# Altium project lamp_controller.PrjPcb (part 3 of 4)
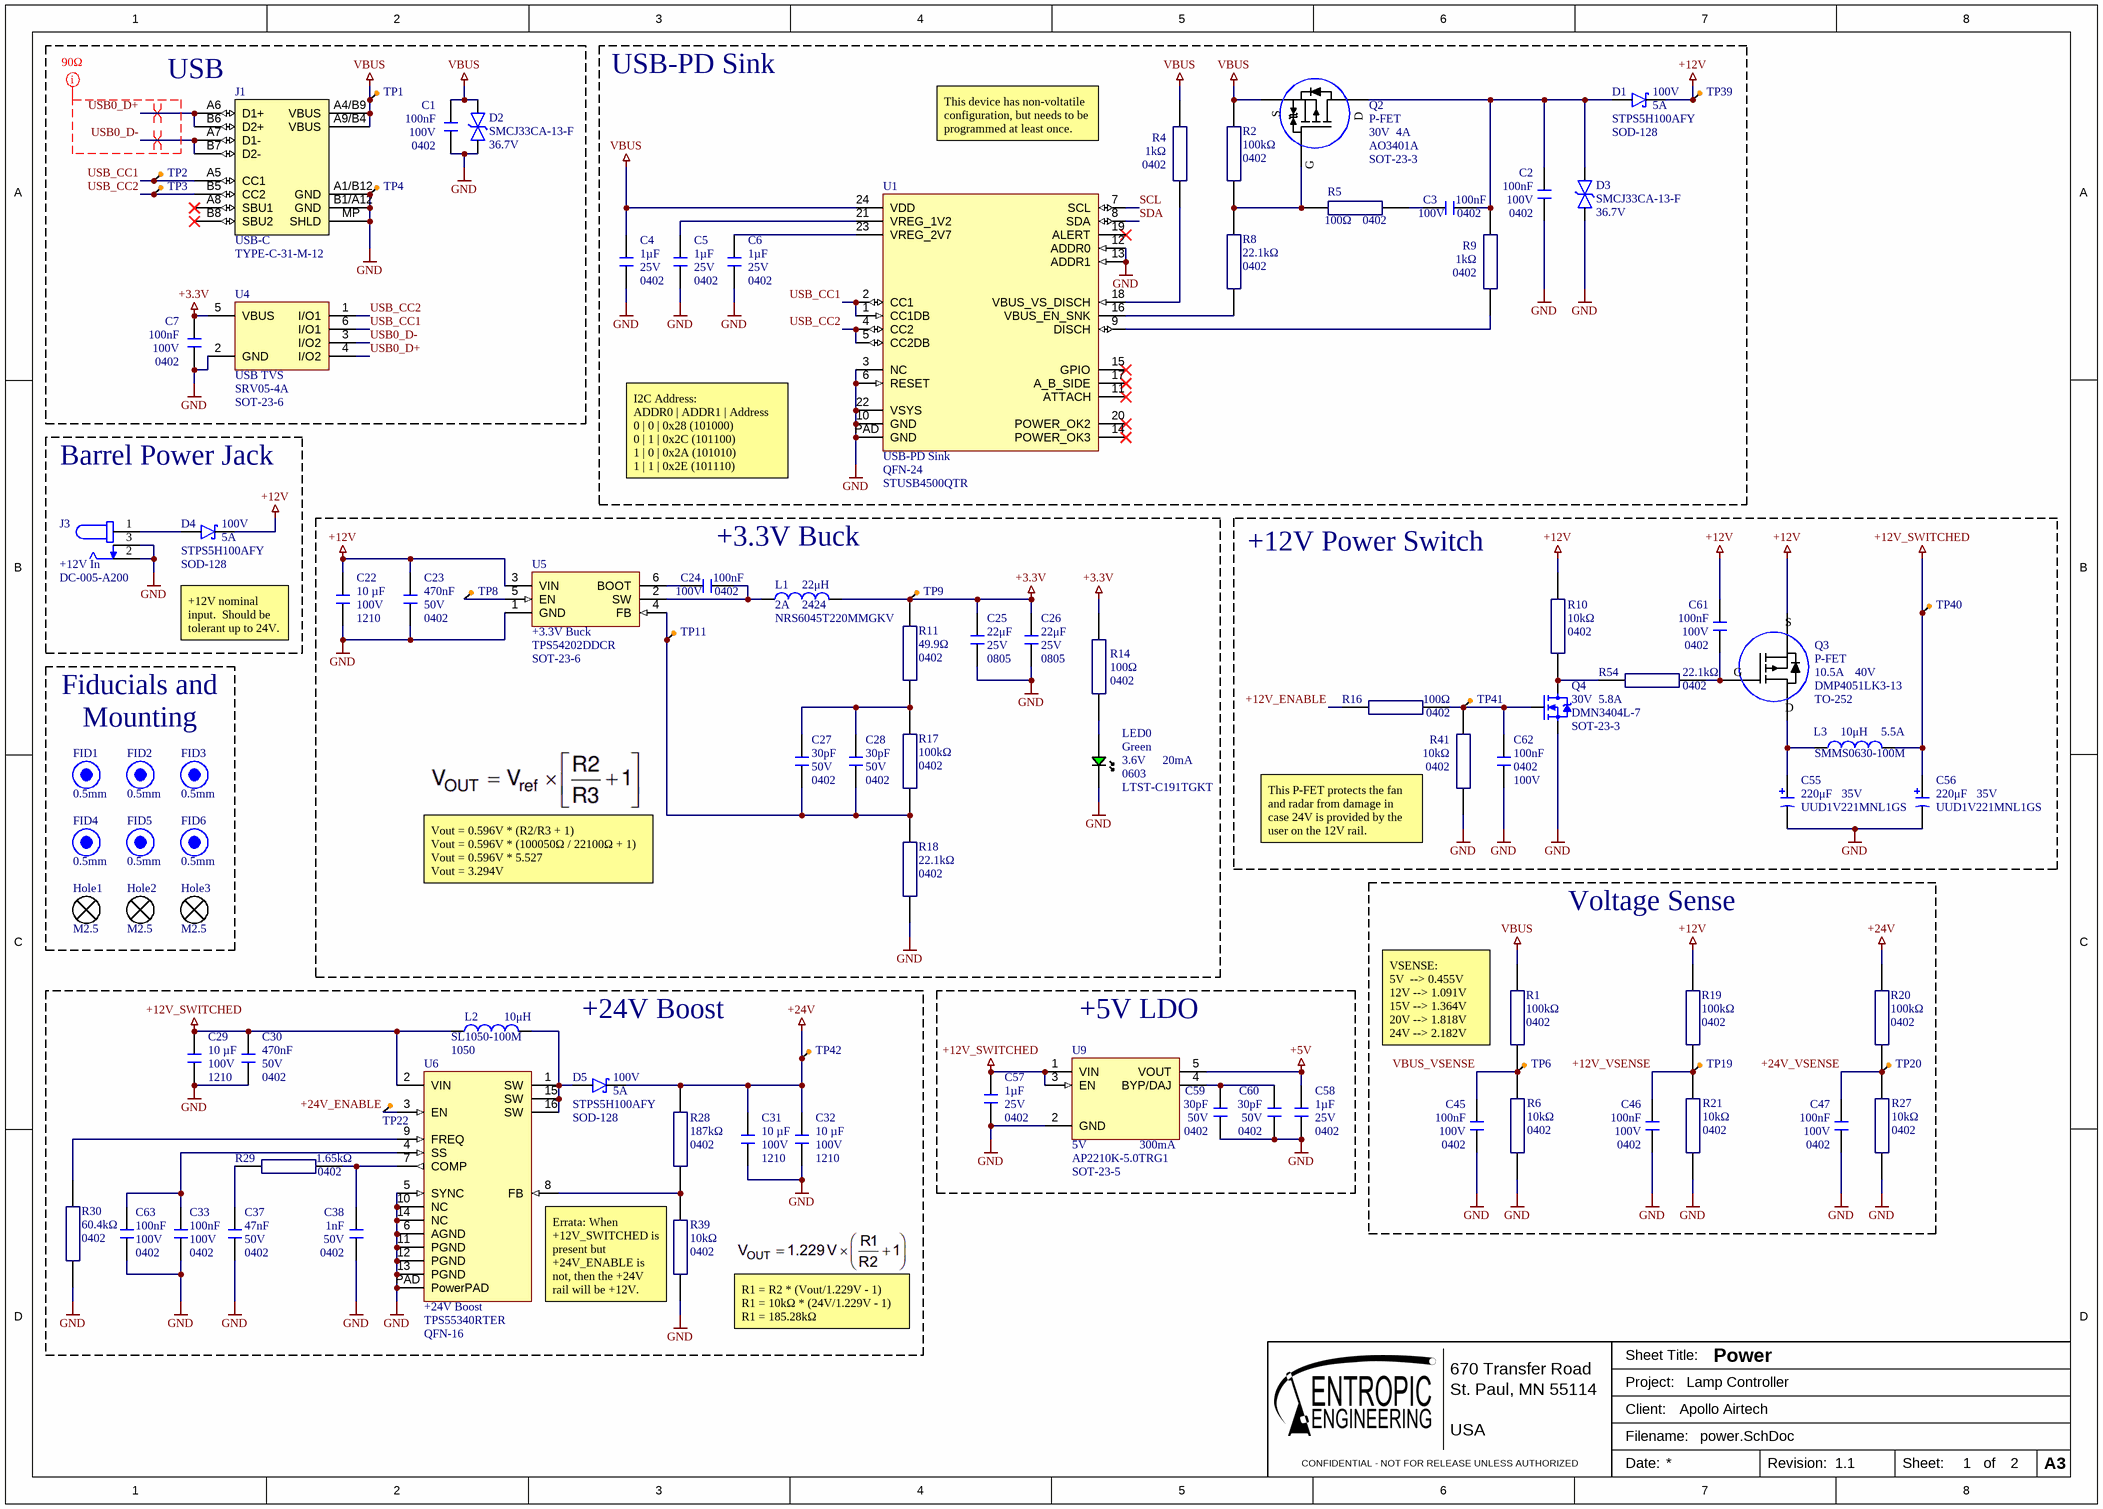
[diagram p4: power.SchDoc]

## Sheet power.SchDoc: Power (continued)

### Library data of the parts (continued)
R54 = RC0402FR-0722K1L: 22.1 kΩ, 1%, 0402 Resistor; Manufacturer: Yageo; Additional Feature: LASER TRIMMABLE; Power: 62.5mW; Rated Temperature: 70°C; Working Voltage: 50V; Temperature Coefficient (ppm/Cel): 100; Package Height: 0.35mm; Package Length: 1mm; Package Width: 0.5mm; Supplier 1: Digikey; Supplier Part Number 1: 311-22.1KLRCT-ND; RoHS: Yes; Category: Chip SMD Resistors; Stock 1: 259657; Pricing 1: 1=0.1, 10=0.008, 100=0.0061, 1000=0.0051, 10000=0.00123 (USD); Min Operating Temperature: -55°C; Max Operating Temperature: 155°C; Tolerance: 1%; Packaging: Tape and Reel; Resistor Type: FIXED RESISTOR; Construction: Chip; RoHS Compliant: Yes; ComponentLink1URL: https://datasheet.ciiva.com:443/pdfs/VipMasterIC/IC/YAGO/YAGO-S-A0008145938/YAGO-S-A0008145938-1.pdf?src-supplier=IHS+Markit; ComponentLink1Description: https://datasheet.ciiva.com:443/pdfs/VipMasterIC/IC/YAGO/YAGO-S-A0008145938/YAGO-S-A0008145938-1.pdf?src-supplier=IHS+Markit; ComponentLink2URL: https://datasheet.ciiva.com/2553/pyu-r-int-thick-7-2553200.pdf?src-supplier=Digikey; ComponentLink2Description: https://datasheet.ciiva.com/2553/pyu-r-int-thick-7-2553200.pdf?src-supplier=Digikey; ComponentLink3URL: https://datasheet.ciiva.com/2553/pyu-r-int-thick-7-2553201.pdf?src-supplier=Digikey; ComponentLink3Description: https://datasheet.ciiva.com/2553/pyu-r-int-thick-7-2553201.pdf?src-supplier=Digikey; ComponentLink4URL: https://datasheet.ciiva.com/2553/pyu-r-int-thick-7-2553202.pdf?src-supplier=Digikey; ComponentLink4Description: https://datasheet.ciiva.com/2553/pyu-r-int-thick-7-2553202.pdf?src-supplier=Digikey; ComponentLink5URL: https://datasheet.ciiva.com/15189/getdatasheetpartid-251817-15189388.pdf?src-supplier=Verical; ComponentLink5Description: https://datasheet.ciiva.com/15189/getdatasheetpartid-251817-15189388.pdf?src-supplier=Verical; Manufacturer Part Number: RC0402FR-0722K1L; Mounting Technology: Surface Mount; Pins: 2; Package Shape: Rectangular; Terminal Finish: Nickel; JESD-609 Code: e3; Technology: METAL GLAZE/THICK FILM; Termination: Wraparound; Reach SVHC Compliant: Yes; ComponentLink6URL: https://datasheet.ciiva.com/7983/1018594-7983501.pdf?src-supplier=Element14; ComponentLink6Description: https://datasheet.ciiva.com/7983/1018594-7983501.pdf?src-supplier=Element14
TP1-TP4 TP6 TP8 TP9 TP11 TP19 TP20 TP22 TP39-TP42 = test_point-1: Test point; pickable: no
U1 = STUSB4500QTR: USB PD Sink; Manufacturer: STMicroelectronics; Consumer IC Type: CONSUMER CIRCUIT; Supplier 1: LCSC; RoHS: Yes; Category: USB Interface ICs; Stock 1: 9434; Pricing 1: 1=1.8642, 10=1.5172, 30=1.3685, 100=1.183, 1000=1.0509, 2000=1.0343 (USD); Reach SVHC Compliant: Yes; RoHS Compliant: Yes; ComponentLink1URL: https://datasheet.ciiva.com:443/pdfs/VipMasterIC/IC/SGST/SGST-S-A0009451278/SGST-S-A0009451278-1.pdf?src-supplier=IHS+Markit; ComponentLink1Description: https://datasheet.ciiva.com:443/pdfs/VipMasterIC/IC/SGST/SGST-S-A0009451278/SGST-S-A0009451278-1.pdf?src-supplier=IHS+Markit; ComponentLink2URL: http://www.farnell.com/datasheets/2710898.pdf?src-supplier=Farnell; ComponentLink2Description: http://www.farnell.com/datasheets/2710898.pdf?src-supplier=Farnell; ComponentLink3URL: http://www.farnell.com/datasheets/2710898.pdf?src-supplier=Element14; ComponentLink3Description: http://www.farnell.com/datasheets/2710898.pdf?src-supplier=Element14; ComponentLink4URL: http://www.farnell.com/datasheets/2710898.pdf?src-supplier=Newark; ComponentLink4Description: http://www.farnell.com/datasheets/2710898.pdf?src-supplier=Newark; ComponentLink5URL: http://www.st.com/content/ccc/resource/technical/document/datasheet/group3/1c/4a/55/d7/17/01/44/86/DM00489312/files/DM00489312.pdf/jcr:content/translations/en.DM00489312.pdf?src-supplier=Digikey; ComponentLink5Description: http://www.st.com/content/ccc/resource/technical/document/datasheet/group3/1c/4a/55/d7/17/01/44/86/DM00489312/files/DM00489312.pdf/jcr:content/translations/en.DM00489312.pdf?src-supplier=Digikey; Supplier Part Number 1: C2678061; Package: QFN-24; Manufacturer Part Number: STUSB4500QTR
U4 = SRV05-4A: TVS DIODE ARRAY SOT23-6; Manufacturer: SMC Diodes; Direction: Unidirectional,Bidirectional; Capacitance: 3.5pF; Operating Supply Voltage: 1.1V; Number of Channels: 2; Breakdown Voltage: 6V; Clamping Voltage: 17V; Reverse Standoff Voltage: 5.25V; Power Line Protection: Yes; Test Current: 1mA; Max Reverse Leakage Current: 150nA; Peak Pulse Current: 5A; Element Configuration: Dual; Data Rate: 480Mbps; Number of Elements: 1; Working Voltage: 5V; RoHS: Yes; Category: TVS Diodes; Stock: 12000; Pricing: 3000=0,05640 (USD); Mount: Surface Mount; Number of Pins: 6; Contact Plating: Tin,Matte; Min Operating Temperature: -40°C; Max Operating Temperature: 125°C; Packaging: Tape and Reel; Package Quantity: 3000; Termination: SMD/SMT; Number of Bidirectional Channels: 2; Min Breakdown Voltage: 6V; ESD Protection: Yes; Leakage Current: 150nA; Series: USB; Reverse Breakdown Voltage: 6V; Polarity: Unidirectional,Bidirectional; Max Breakdown Voltage: 6V; Clamping Voltage-Max: 17V; Length: 3.05mm; Width: 1.75mm; Height: 1.3mm; Depth: 1.75mm; Radiation Hardening: No; REACH SVHC: No SVHC; Lead Free: Lead Free; RoHS Compliant: Yes; ComponentLink1URL: https://datasheet.ciiva.com/1268/1690354-1268384.pdf?src-supplier=Element14; ComponentLink1Description: https://datasheet.ciiva.com/1268/1690354-1268384.pdf?src-supplier=Element14; ComponentLink2URL: https://datasheet.ciiva.com/4508/cd00050750-113117-4508433.pdf?src-supplier=Mouser; ComponentLink2Description: https://datasheet.ciiva.com/4508/cd00050750-113117-4508433.pdf?src-supplier=Mouser; ComponentLink3URL: https://datasheet.ciiva.com/15143/getdatasheetpartid-148465-15143789.pdf?src-supplier=Verical; ComponentLink3Description: https://datasheet.ciiva.com/15143/getdatasheetpartid-148465-15143789.pdf?src-supplier=Verical; ComponentLink4URL: https://datasheet.ciiva.com/16200/cd00050750-16200026.pdf?src-supplier=Future+Electronics; ComponentLink4Description: https://datasheet.ciiva.com/16200/cd00050750-16200026.pdf?src-supplier=Future+Electronics; ComponentLink5URL: https://datasheet.ciiva.com/41444/001184109-da-01-en-ic-esd-protecti-usblc6-2sc6-sot-23-6-stm-41444156.pdf?src-supplier=Conrad; ComponentLink5Description: https://datasheet.ciiva.com/41444/001184109-da-01-en-ic-esd-protecti-usblc6-2sc6-sot-23-6-stm-41444156.pdf?src-supplier=Conrad; Supplier 1: LCSC; Supplier Part Number 1: C260410; Manufacturer Part Number: SRV05-4A; house_part_number: SRV05-4A
U5 = TPS54202DDCR: Switching Regulator, Current-mode, 2A, 500kHz Switching Freq-Max, PDSO6; Manufacturer: Texas Instruments; Package Body Material: Plastic; Control Technique: PULSE WIDTH MODULATION; Max Supply Voltage: 28V; Min Input Voltage: 4.5V; Nominal Supply Voltage: 12V; Channels: 1; Max Output current: 3.9A; Frequency: 590kHz; Supplier 1: Digi-Key; RoHS: Yes; Category: Voltage Regulators - Switching; Stock 1: 4766; Pricing 1: 1=1.29, 10=1.154, 25=1.0956, 100=0.9001, 250=0.8414, 500=0.74356, 1000=0.58702 (USD); Pins: 6; Package Shape: Rectangular; Terminal Finish: Tin; Min Operating Temperature: -40°C; Max Operating Temperature: 125°C; JESD-609 Code: e3; Throw Configuration: SWITCHING REGULATOR; Control Mode: CURRENT-MODE; JESD-30 Code: R-PDSO-G6; Moisture Sensitivity Level: 1; Package Style: SMALL OUTLINE, THIN PROFILE, SHRINK PITCHMeter; Surface Mount: Yes; Switcher Configuration: BUCK; Terminal Form: Gull Wing; Terminal Position: DUAL; Length: 2.9mm; Width: 1.6mm; Height - Seated (Max): 1.1mm; Terminal Pitch: 0.95mm; Temperature Grade: AUTOMOTIVE; Reach SVHC Compliant: Yes; RoHS Compliant: Yes; ComponentLink1URL: https://www.ti.com:443/lit/ds/symlink/tps54202.pdf?src-supplier=IHS+Markit; ComponentLink1Description: https://www.ti.com:443/lit/ds/symlink/tps54202.pdf?src-supplier=IHS+Markit; ComponentLink2URL: http://www.ti.com/general/docs/suppproductinfo.tsp?distId=10&gotoUrl=http%3A%2F%2Fwww.ti.com%2Flit%2Fgpn%2Ftps54202&src-supplier=Digi-Key; ComponentLink2Description: http://www.ti.com/general/docs/suppproductinfo.tsp?distId=10&gotoUrl=http%3A%2F%2Fwww.ti.com%2Flit%2Fgpn%2Ftps54202&src-supplier=Digi-Key; ComponentLink3URL: http://www.ti.com/lit/ds/symlink/tps54202.pdf?src-supplier=Digi-Key; ComponentLink3Description: http://www.ti.com/lit/ds/symlink/tps54202.pdf?src-supplier=Digi-Key; ComponentLink4URL: http://www.ti.com/general/docs/suppproductinfo.tsp?distId=10&amp;gotoUrl=http%3A%2F%2Fwww.ti.com%2Flit%2Fgpn%2Ftps54202&src-supplier=Digi-Key; ComponentLink4Description: http://www.ti.com/general/docs/suppproductinfo.tsp?distId=10&amp;gotoUrl=http%3A%2F%2Fwww.ti.com%2Flit%2Fgpn%2Ftps54202&src-supplier=Digi-Key; Supplier Part Number 1: 296-TPS54202DDCRDKR-ND; Case/Package: SOT-23-6; Manufacturer Part Number: TPS54202DDCR
U6 = TPS55340RTER: Boost, 32V, 7.75A, QFN-16; Manufacturer: Texas Instruments; Package Body Material: Plastic; Throw Configuration: SWITCHING REGULATOR; Control Mode: CURRENT-MODE; Control Technique: PULSE WIDTH MODULATION; Min Input Voltage: 2.9V; Nominal Supply Voltage: 5V; Channels: 1; Frequency: 1.48MHz; Qualification Status: Not Qualified; Supplier 1: LCSC; RoHS: Yes; Category: Voltage Regulators - Switching; Stock 1: 2560; Pricing 1: 1=0.8828, 10=0.7582, 30=0.6705, 100=0.5967, 500=0.5168, 1000=0.5029 (USD); Case/Package: HVQCCN; Pins: 16; Package Shape: Square; Terminal Finish: Nickel; Min Operating Temperature: -40°C; Max Operating Temperature: 150°C; JESD-609 Code: e4; Max Supply Voltage: 32V; JESD-30 Code: S-PQCC-N16; Moisture Sensitivity Level: 2; Max Output current: 7.75A; Package Style: CHIP CARRIER, HEAT SINK/SLUG, VERY THIN PROFILEMeter; Peak Reflow Temperature (Cel): 260°C; Surface Mount: Yes; Switcher Configuration: BOOST; Terminal Form: No Lead; Terminal Position: QUAD; Length: 3mm; Width: 3mm; Height - Seated (Max): 0.8mm; Terminal Pitch: 0.5mm; Temperature Grade: AUTOMOTIVE; Reach SVHC Compliant: Yes; RoHS Compliant: Yes; ComponentLink1URL: https://www.ti.com:443/lit/ds/symlink/tps55340.pdf?src-supplier=IHS+Markit; ComponentLink1Description: https://www.ti.com:443/lit/ds/symlink/tps55340.pdf?src-supplier=IHS+Markit; ComponentLink2URL: https://datasheet.ciiva.com/41798/tps55340-41798808.pdf?src-supplier=Digikey; ComponentLink2Description: https://datasheet.ciiva.com/41798/tps55340-41798808.pdf?src-supplier=Digikey; ComponentLink3URL: https://datasheet.ciiva.com/14377/tps55340-14377094.pdf?src-supplier=Avnet; ComponentLink3Description: https://datasheet.ciiva.com/14377/tps55340-14377094.pdf?src-supplier=Avnet; Supplier Part Number 1: C169167; Manufacturer Part Number: TPS55340RTER
U9 = AP2210K-5.0TRG1: 5 V, 300 mA LDO, SOT-23-5; Manufacturer: Diodes; Package Body Material: Plastic; Dropout Voltage1-Max: 500mV; Max Supply Voltage: 13.2V; Min Input Voltage: 6V; Channels: 1; Output Voltage1-Max: 5.1V; Output Voltage1-Min: 4.9V; Regulator Type: FIXED POSITIVE SINGLE OUTPUT LDO REGULATOR; Supplier 1: LCSC; RoHS: Yes; Category: Voltage Regulators - Linear; Stock 1: 4255; Pricing 1: 5=0.1337, 50=0.1058, 150=0.0919, 500=0.0815, 3000=0.0657, 6000=0.0615 (USD); Pins: 5; Package Shape: Rectangular; Terminal Finish: Tin; JESD-609 Code: e3; JESD-30 Code: R-PDSO-G5; Moisture Sensitivity Level: 3; Operating Temperature, TJ-Max: 125°C; Operating Temperature, TJ-Min: -40°C; Package Style: SMALL OUTLINE, LOW PROFILE, SHRINK PITCHMeter; Surface Mount: Yes; Terminal Form: Gull Wing; Terminal Position: DUAL; Length: 2.9mm; Width: 1.6mm; Height - Seated (Max): 1.45mm; Terminal Pitch: 0.95mm; Reach SVHC Compliant: Yes; RoHS Compliant: Yes; ComponentLink1URL: https://datasheet.ciiva.com:443/pdfs/VipMasterIC/IC/DIOD/DIOD-S-A0002238385/DIOD-S-A0002238385-1.pdf?src-supplier=IHS+Markit; ComponentLink1Description: https://datasheet.ciiva.com:443/pdfs/VipMasterIC/IC/DIOD/DIOD-S-A0002238385/DIOD-S-A0002238385-1.pdf?src-supplier=IHS+Markit; ComponentLink2URL: https://datasheet.ciiva.com/29569/ap2210-29569974.pdf?src-supplier=Digikey; ComponentLink2Description: https://datasheet.ciiva.com/29569/ap2210-29569974.pdf?src-supplier=Digikey; ComponentLink3URL: https://datasheet.ciiva.com/29569/ap2210-29569975.pdf?src-supplier=Digikey; ComponentLink3Description: https://datasheet.ciiva.com/29569/ap2210-29569975.pdf?src-supplier=Digikey; ComponentLink4URL: https://datasheet.ciiva.com/29569/ap2210-29569976.pdf?src-supplier=Digikey; ComponentLink4Description: https://datasheet.ciiva.com/29569/ap2210-29569976.pdf?src-supplier=Digikey; Supplier Part Number 1: C500758; Case/Package: SOT-23-5; Manufacturer Part Number: AP2210K-5.0TRG1

## Sheet lamp_controller.SchDoc: Lamp Controller
size 594 x 420 mm; SheetNumber: 2; SheetTotal: 2
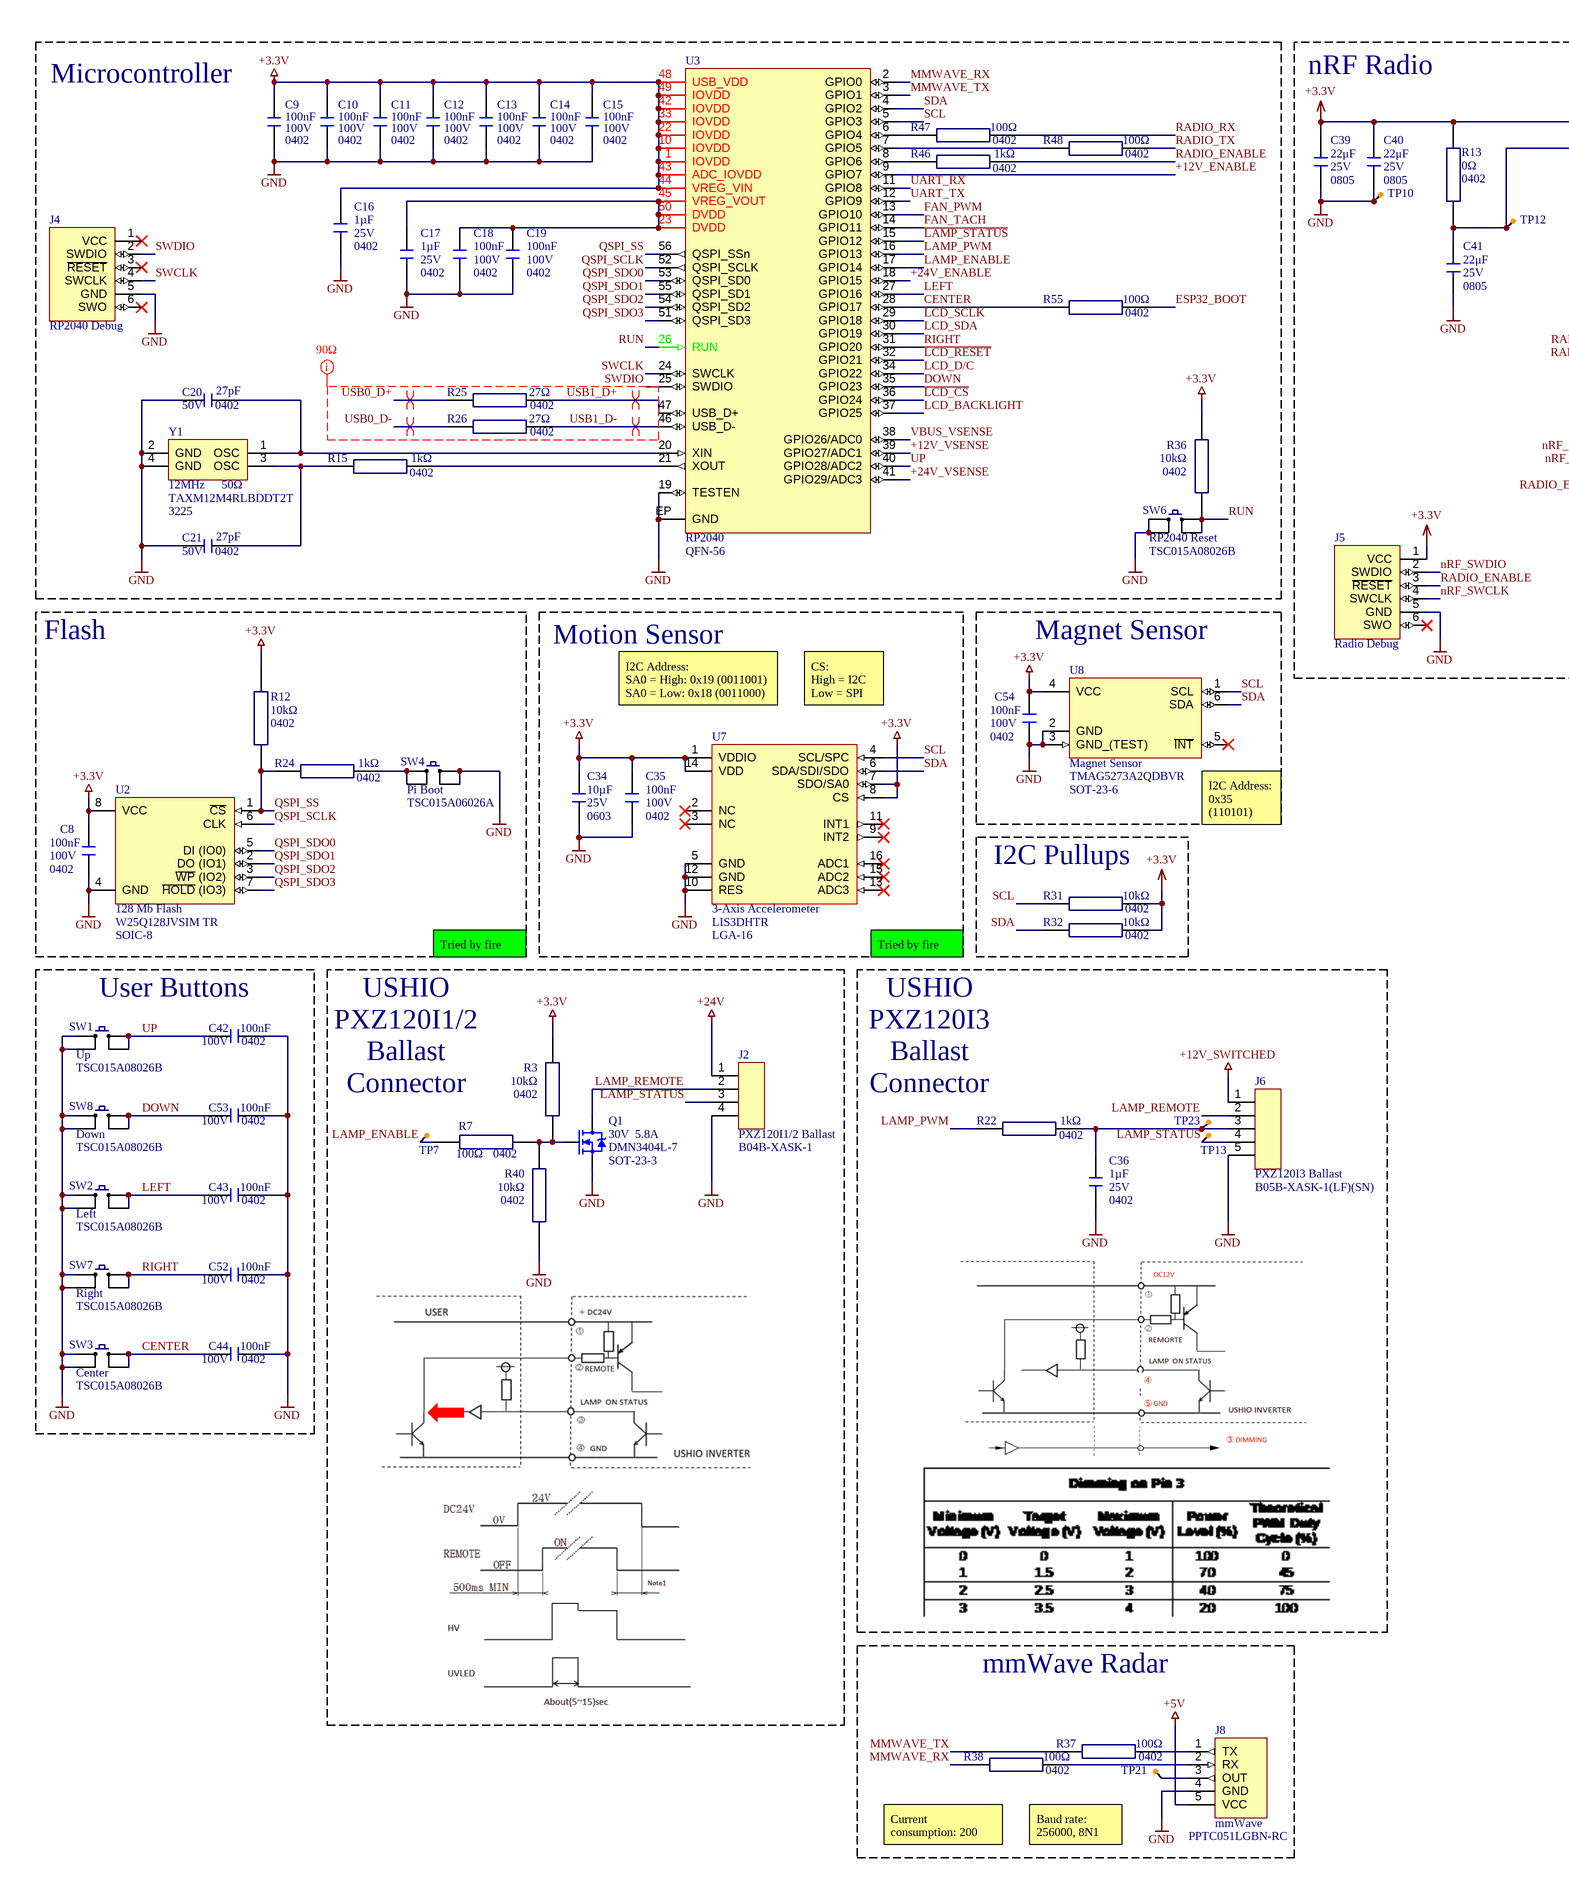
[diagram p1: lamp_controller.SchDoc, left]
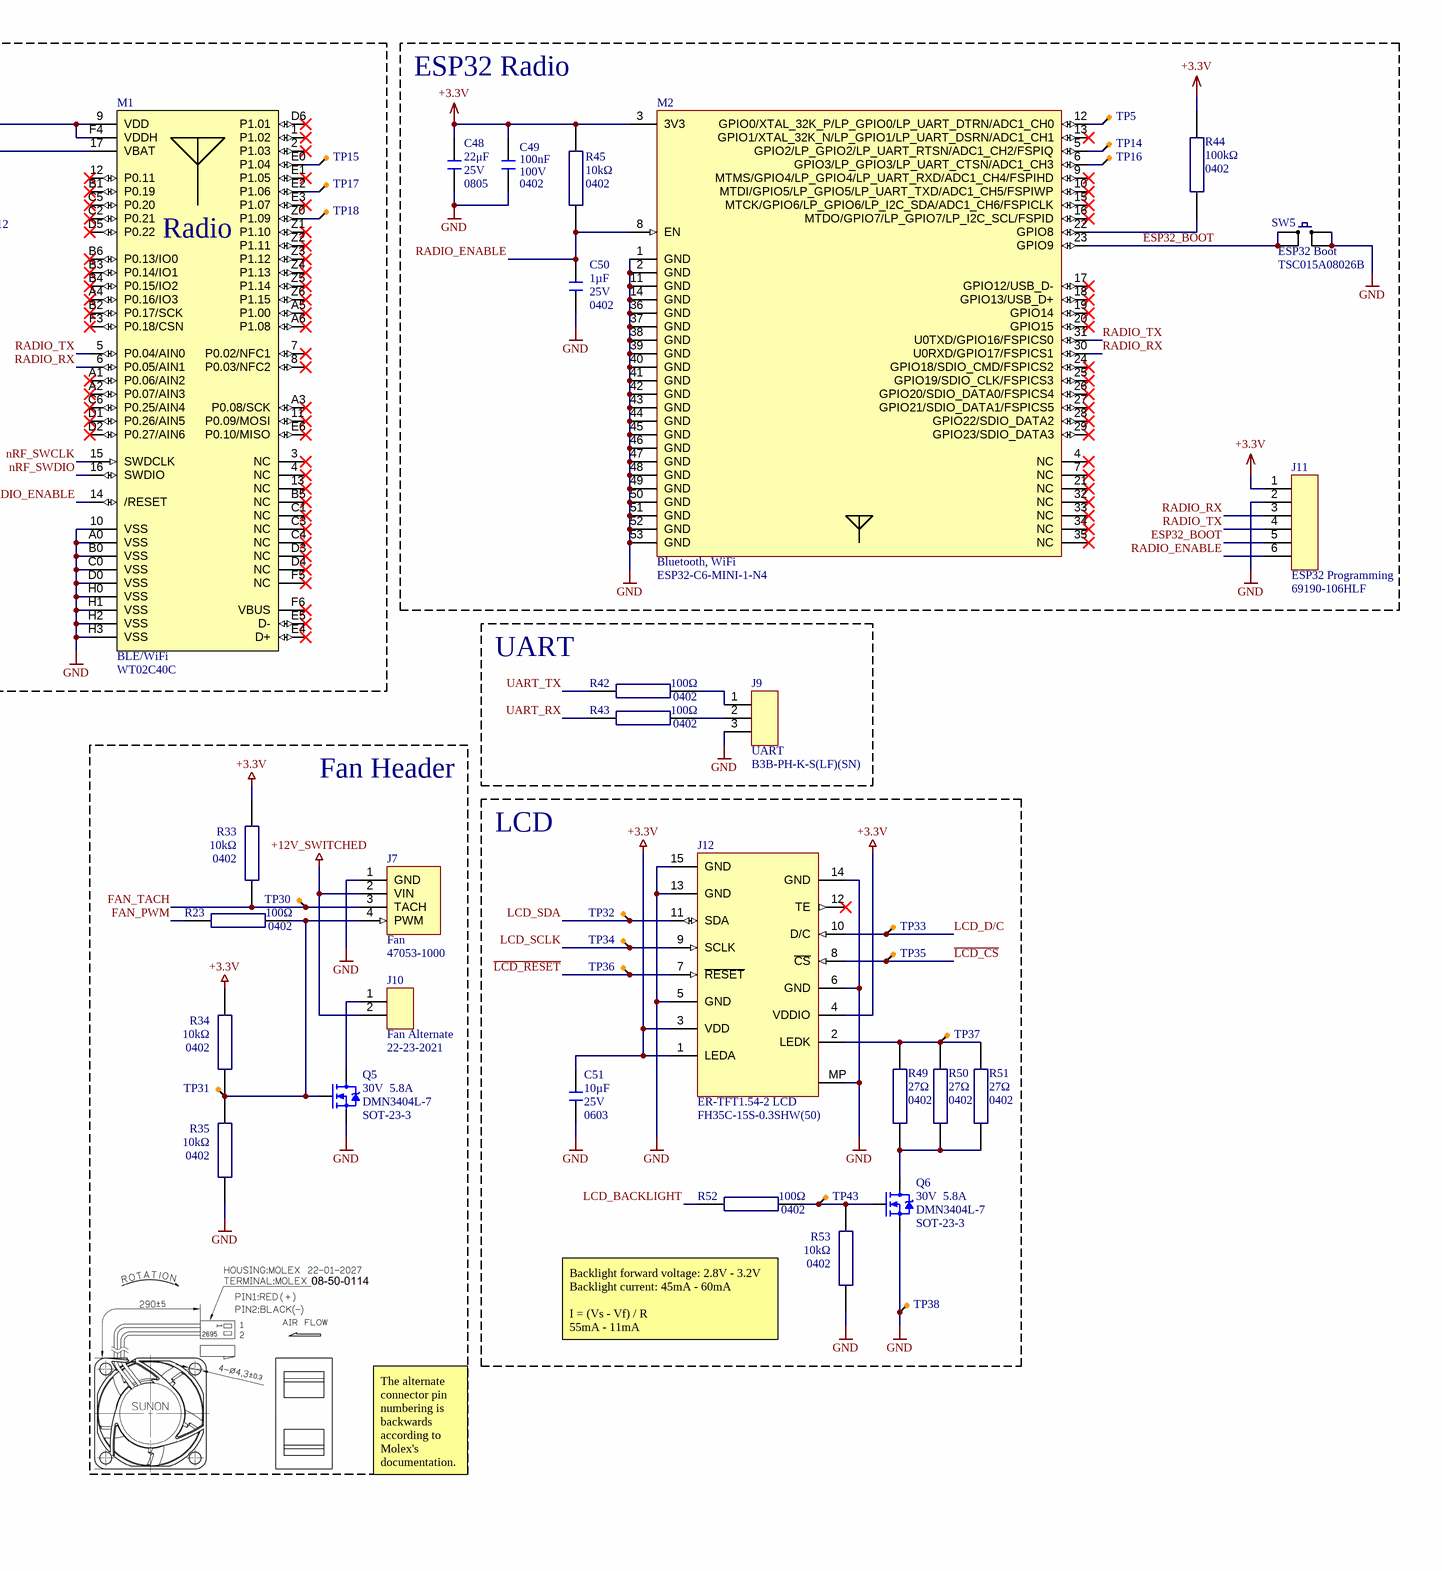
[diagram p2: lamp_controller.SchDoc, right]

### Parts
C8  value 100nF  Case/Package: 0402  Rated DC Voltage (URdc): 100V  [0402_capacitor]  (hidden comment: GRM155R62A104KE14D)
C9  value 100nF  Case/Package: 0402  Rated DC Voltage (URdc): 100V  [0402_capacitor]  (hidden comment: GRM155R62A104KE14D)
C10  value 100nF  Case/Package: 0402  Rated DC Voltage (URdc): 100V  [0402_capacitor]  (hidden comment: GRM155R62A104KE14D)
C11  value 100nF  Case/Package: 0402  Rated DC Voltage (URdc): 100V  [0402_capacitor]  (hidden comment: GRM155R62A104KE14D)
C12  value 100nF  Case/Package: 0402  Rated DC Voltage (URdc): 100V  [0402_capacitor]  (hidden comment: GRM155R62A104KE14D)
C13  value 100nF  Case/Package: 0402  Rated DC Voltage (URdc): 100V  [0402_capacitor]  (hidden comment: GRM155R62A104KE14D)
C14  value 100nF  Case/Package: 0402  Rated DC Voltage (URdc): 100V  [0402_capacitor]  (hidden comment: GRM155R62A104KE14D)
C15  value 100nF  Case/Package: 0402  Rated DC Voltage (URdc): 100V  [0402_capacitor]  (hidden comment: GRM155R62A104KE14D)
C16  Size Code: 0402  Capacitance: 1µF  Voltage: 25V  [0402_capacitor]  (hidden comment: GRM155R61E105KA12D)
C17  Size Code: 0402  Capacitance: 1µF  Voltage: 25V  [0402_capacitor]  (hidden comment: GRM155R61E105KA12D)
C18  value 100nF  Case/Package: 0402  Rated DC Voltage (URdc): 100V  [0402_capacitor]  (hidden comment: GRM155R62A104KE14D)
C19  value 100nF  Case/Package: 0402  Rated DC Voltage (URdc): 100V  [0402_capacitor]  (hidden comment: GRM155R62A104KE14D)
C20  value 27pF  Case/Package: 0402  Voltage Rating (DC): 50V  [0402_capacitor]  (hidden comment: CC0402JRNPO9BN270)
C21  value 27pF  Case/Package: 0402  Voltage Rating (DC): 50V  [0402_capacitor]  (hidden comment: CC0402JRNPO9BN270)
C34  value 10µF  Case/Package: 0603  Voltage Rating: 25V  [0603_capacitor]  (hidden comment: CL10A106MA8NRNC)
C35  value 100nF  Case/Package: 0402  Rated DC Voltage (URdc): 100V  [0402_capacitor]  (hidden comment: GRM155R62A104KE14D)
C36  Size Code: 0402  Capacitance: 1µF  Voltage: 25V  [0402_capacitor]  (hidden comment: GRM155R61E105KA12D)
C39  value 22μF  Rated DC Voltage (URdc): 25V  Case/Package: 0805  [0805_capacitor]  (hidden comment: GRT21BR61E226ME13L)
C40  value 22μF  Rated DC Voltage (URdc): 25V  Case/Package: 0805  [0805_capacitor]  (hidden comment: GRT21BR61E226ME13L)
C41  value 22μF  Rated DC Voltage (URdc): 25V  Case/Package: 0805  [0805_capacitor]  (hidden comment: GRT21BR61E226ME13L)
C42  value 100nF  Case/Package: 0402  Rated DC Voltage (URdc): 100V  [0402_capacitor]  (hidden comment: GRM155R62A104KE14D)
C43  value 100nF  Case/Package: 0402  Rated DC Voltage (URdc): 100V  [0402_capacitor]  (hidden comment: GRM155R62A104KE14D)
C44  value 100nF  Case/Package: 0402  Rated DC Voltage (URdc): 100V  [0402_capacitor]  (hidden comment: GRM155R62A104KE14D)
C48  value 22μF  Rated DC Voltage (URdc): 25V  Case/Package: 0805  [0805_capacitor]  (hidden comment: GRT21BR61E226ME13L)
C49  value 100nF  Case/Package: 0402  Rated DC Voltage (URdc): 100V  [0402_capacitor]  (hidden comment: GRM155R62A104KE14D)
C50  Size Code: 0402  Capacitance: 1µF  Voltage: 25V  [0402_capacitor]  (hidden comment: GRM155R61E105KA12D)
C51  value 10µF  Case/Package: 0603  Voltage Rating: 25V  [0603_capacitor]  (hidden comment: CL10A106MA8NRNC)
C52  value 100nF  Case/Package: 0402  Rated DC Voltage (URdc): 100V  [0402_capacitor]  (hidden comment: GRM155R62A104KE14D)
C53  value 100nF  Case/Package: 0402  Rated DC Voltage (URdc): 100V  [0402_capacitor]  (hidden comment: GRM155R62A104KE14D)
C54  value 100nF  Case/Package: 0402  Rated DC Voltage (URdc): 100V  [0402_capacitor]  (hidden comment: GRM155R62A104KE14D)
J2  PXZ120I1/2 Ballast  [B04B-XASK-1]
J4  RP2040 Debug  [debug_header_dual]  (no BOM)
J5  Radio Debug  [debug_header_dual]  (no BOM)
J6  PXZ120I3 Ballast  [B05B-XASK-1]
J7  Fan  Manufacturer Part Number: 47053-1000  [470531000]
J8  mmWave  [radar_angled_1]
J9  UART  [B3B-PH-K-S(LF)(SN)]
J10  Fan Alternate  [22012027]
J11  ESP32 Programming  [69190-106HLF]
J12  ER-TFT1.54-2 LCD  [FH35C-15S-0.3SHW(50)]
M1  BLE/WiFi  [WT02C40C]
M2  Bluetooth, WiFi  [ESP32-C6-MINI-1]
Q1  DS Breakdown Voltage-Min: 30V  Drain Current-Max (ID): 5.8A  [SOT-23-3]  (hidden comment: DMN3404L-7)
Q5  DS Breakdown Voltage-Min: 30V  Drain Current-Max (ID): 5.8A  [SOT-23-3]  (hidden comment: DMN3404L-7)
Q6  DS Breakdown Voltage-Min: 30V  Drain Current-Max (ID): 5.8A  [SOT-23-3]  (hidden comment: DMN3404L-7)
R3  Case Code (Imperial): 0402  Resistance: 10kΩ  [0402_resistor]  (hidden comment: RMCF0402FT10K0)
R7  Case Code (Imperial): 0402  Resistance: 100Ω  [0402_resistor]  (hidden comment: RMCF0402FT100R)
R12  Case Code (Imperial): 0402  Resistance: 10kΩ  [0402_resistor]  (hidden comment: RMCF0402FT10K0)
R13  Resistance: 0Ω  Case/Package: 0402  [0402_resistor]  (hidden comment: RMCF0402ZT0R00)
R15  Size Code: 0402  Resistance: 1kΩ  [0402_resistor]  (hidden comment: CR0402-FX-1001GLF)
R22  Size Code: 0402  Resistance: 1kΩ  [0402_resistor]  (hidden comment: CR0402-FX-1001GLF)
R23  Case Code (Imperial): 0402  Resistance: 100Ω  [0402_resistor]  (hidden comment: RMCF0402FT100R)
R24  Size Code: 0402  Resistance: 1kΩ  [0402_resistor]  (hidden comment: CR0402-FX-1001GLF)
R25  Resistance: 27Ω  Size Code: 0402  [0402_resistor]  (hidden comment: RMCF0402FT27R0)
R26  Resistance: 27Ω  Size Code: 0402  [0402_resistor]  (hidden comment: RMCF0402FT27R0)
R31  Case Code (Imperial): 0402  Resistance: 10kΩ  [0402_resistor]  (hidden comment: RMCF0402FT10K0)
R32  Case Code (Imperial): 0402  Resistance: 10kΩ  [0402_resistor]  (hidden comment: RMCF0402FT10K0)
R33  Case Code (Imperial): 0402  Resistance: 10kΩ  [0402_resistor]  (hidden comment: RMCF0402FT10K0)
R34  Case Code (Imperial): 0402  Resistance: 10kΩ  [0402_resistor]  (hidden comment: RMCF0402FT10K0)
R35  Case Code (Imperial): 0402  Resistance: 10kΩ  [0402_resistor]  (hidden comment: RMCF0402FT10K0)
R36  Case Code (Imperial): 0402  Resistance: 10kΩ  [0402_resistor]  (hidden comment: RMCF0402FT10K0)
R37  Case Code (Imperial): 0402  Resistance: 100Ω  [0402_resistor]  (hidden comment: RMCF0402FT100R)
R38  Case Code (Imperial): 0402  Resistance: 100Ω  [0402_resistor]  (hidden comment: RMCF0402FT100R)
R40  Case Code (Imperial): 0402  Resistance: 10kΩ  [0402_resistor]  (hidden comment: RMCF0402FT10K0)
R42  Case Code (Imperial): 0402  Resistance: 100Ω  [0402_resistor]  (hidden comment: RMCF0402FT100R)
R43  Case Code (Imperial): 0402  Resistance: 100Ω  [0402_resistor]  (hidden comment: RMCF0402FT100R)
R44  value 100kΩ  Case/Package: 0402  [0402_resistor]  (hidden comment: RMCF0402FT100K)
R45  Case Code (Imperial): 0402  Resistance: 10kΩ  [0402_resistor]  (hidden comment: RMCF0402FT10K0)
R46  Size Code: 0402  Resistance: 1kΩ  [0402_resistor]  (hidden comment: CR0402-FX-1001GLF)
R47  Case Code (Imperial): 0402  Resistance: 100Ω  [0402_resistor]  (hidden comment: RMCF0402FT100R)
R48  Case Code (Imperial): 0402  Resistance: 100Ω  [0402_resistor]  (hidden comment: RMCF0402FT100R)
R49  Resistance: 27Ω  Size Code: 0402  [0402_resistor]  (hidden comment: RMCF0402FT27R0)
R50  Resistance: 27Ω  Size Code: 0402  [0402_resistor]  (hidden comment: RMCF0402FT27R0)
R51  Resistance: 27Ω  Size Code: 0402  [0402_resistor]  (hidden comment: RMCF0402FT27R0)
R52  Case Code (Imperial): 0402  Resistance: 100Ω  [0402_resistor]  (hidden comment: RMCF0402FT100R)
R53  Case Code (Imperial): 0402  Resistance: 10kΩ  [0402_resistor]  (hidden comment: RMCF0402FT10K0)
R55  Case Code (Imperial): 0402  Resistance: 100Ω  [0402_resistor]  (hidden comment: RMCF0402FT100R)
SW1  Up  [TSC015A08026B]
SW2  Left  [TSC015A08026B]
SW3  Center  [TSC015A08026B]
SW4  Pi Boot  [TSC015A06026A]
SW5  ESP32 Boot  [TSC015A08026B]
SW6  RP2040 Reset  [TSC015A08026B]
SW7  Right  [TSC015A08026B]
SW8  Down  [TSC015A08026B]
TP5  *  [test_point-1]  (value not drawn)  (no BOM)
TP7  Lamp Enable  [test_point-1]  (value not drawn)  (no BOM)
TP10  GND  [test_point-1]  (value not drawn)  (no BOM)
TP12  nRF_VBAT  [test_point-1]  (value not drawn)  (no BOM)
TP13  Lamp Status  [test_point-1]  (value not drawn)  (no BOM)
TP14  *  [test_point-1]  (value not drawn)  (no BOM)
TP15  *  [test_point-1]  (value not drawn)  (no BOM)
TP16  *  [test_point-1]  (value not drawn)  (no BOM)
TP17  *  [test_point-1]  (value not drawn)  (no BOM)
TP18  *  [test_point-1]  (value not drawn)  (no BOM)
TP21  RADAR Out  [test_point-1]  (value not drawn)  (no BOM)
TP23  nRF_VBAT  [test_point-1]  (value not drawn)  (no BOM)
TP30  Fan Tach  [test_point-1]  (value not drawn)  (no BOM)
TP31  Fan PWM  [test_point-1]  (value not drawn)  (no BOM)
TP32  LCD SDA  [test_point-1]  (value not drawn)  (no BOM)
TP33  LCD D/C  [test_point-1]  (value not drawn)  (no BOM)
TP34  LCD SCLK  [test_point-1]  (value not drawn)  (no BOM)
TP35  \LCD CS  [test_point-1]  (value not drawn)  (no BOM)
TP36  \LCD Reset  [test_point-1]  (value not drawn)  (no BOM)
TP37  LED K  [test_point-1]  (value not drawn)  (no BOM)
TP38  GND  [test_point-1]  (value not drawn)  (no BOM)
TP43  LCB Backlight  [test_point-1]  (value not drawn)  (no BOM)
U2  128 Mb Flash  Case/Package: SOIC-8  [SOIC-8_wide]
U3  RP2040  [QFN-56]
U7  3-Axis Accelerometer  Case/Package: LGA-16  [LGA50P300X300X100-16N]
U8  Magnet Sensor  [SOT-23-6]
Y1  value 12MHz  ESR: 50Ω  Case/Package: 3225  [3225_crystal]  (hidden comment: TAXM12M4RLBDDT2T)

### Blocks framed on the sheet
nRF Radio: C39-C41 J5 M1 R13 TP10 TP12 TP15 TP17 TP18
ESP32 Radio: C48-C50 J11 M2 R44 R45 SW5 TP5 TP14 TP16
Motion Sensor: C34 C35 U7
UART: J9 R42 R43
Fan Header: J7 J10 Q5 R23 R33-R35 TP30 TP31
LCD: C51 J12 Q6 R49-R53 TP32-TP38 TP43

### Nets
+3.3V: C8.2 C9.2 C10.2 C11.2 C12.2 C13.2 C14.2 C15.2 C16.2 C34.2 C35.2 C39.2 C40.2 C48.2 C49.2 C51.2 C54.2 J5.1(VCC) J11.1 J12.1(LEDA) J12.3(VDD) J12.4(VDDIO) M1.9(VDD) M1.F4(VDDH) M2.3(3V3) R3.1 R12.2 R13.1 R31.1 R32.1 R33.1 R34.1 R36.1 R44.2 R45.2 U2.8(VCC) U3.1(IOVDD) U3.10(IOVDD) U3.22(IOVDD) U3.33(IOVDD) U3.42(IOVDD) U3.43(ADC_IOVDD) U3.44(VREG_VIN) U3.48(USB_VDD) U3.49(IOVDD) U7.1(VDDIO) U7.7(SDO/SA0) U7.8(CS) U7.14(VDD) U8.4(VCC)
+5V: J8.5(VCC)
+12V_SWITCHED: J6.1 J7.2(VIN) J10.2
+24V: J2.1
GND: C8.1 C9.1 C10.1 C11.1 C12.1 C13.1 C14.1 C15.1 C16.1 C17.1 C18.1 C19.1 C20.1 C21.1 C34.1 C35.1 C36.1 C39.1 C40.1 C41.1 C42.1 C43.1 C44.1 C48.1 C49.1 C50.1 C51.1 C52.1 C53.1 C54.1 J2.4 J4.5(GND) J5.5(GND) J6.5 J7.1(GND) J8.4(GND) J9.3 J11.2 J12.5(GND) J12.6(GND) J12.13(GND) J12.14(GND) J12.15(GND) J12.MP M1.10(VSS) M1.A0(VSS) M1.B0(VSS) M1.C0(VSS) M1.D0(VSS) M1.H0(VSS) M1.H1(VSS) M1.H2(VSS) M1.H3(VSS) M2.1(GND) M2.2(GND) M2.11(GND) M2.14(GND) M2.36(GND) M2.37(GND) M2.38(GND) M2.39(GND) M2.40(GND) M2.41(GND) M2.42(GND) M2.43(GND) M2.44(GND) M2.45(GND) M2.46(GND) M2.47(GND) M2.48(GND) M2.49(GND) M2.50(GND) M2.51(GND) M2.52(GND) M2.53(GND) Q1.2(S) Q5.2(S) Q6.2(S) R35.2 R40.2 R53.2 SW1.1 SW1.2 SW2.1 SW2.2 SW3.1 SW3.2 SW4.3 SW4.4 SW5.3 SW5.4 SW6.1 SW6.2 SW7.1 SW7.2 SW8.1 SW8.2 TP10.1 TP38.1 U2.4(GND) U3.19(TESTEN) U3.EP(GND) U7.5(GND) U7.10(RES) U7.12(GND) U8.2(GND) U8.3(GND_(TEST)) Y1.2(GND) Y1.4(GND)
+12V_ENABLE: U3.9(GPIO7)
+12V_VSENSE: U3.39(GPIO27/ADC1)
+24V_ENABLE: U3.18(GPIO15)
+24V_VSENSE: U3.41(GPIO29/ADC3)
~{LAMP_STATUS}: J2.3 J6.4 TP13.1 U3.15(GPIO12)
~{LCD_CS}: J12.8(~{CS}) TP35.1 U3.36(GPIO24)
~{LCD_RESET}: J12.7(~{RESET}) TP36.1 U3.32(GPIO21)
CENTER: C44.2 R55.1 SW3.3 SW3.4 U3.28(GPIO17)
DOWN: C53.2 SW8.3 SW8.4 U3.35(GPIO23)
ESP32_BOOT: J11.5 M2.23(GPIO9) R55.2 SW5.1 SW5.2
FAN_PWM: R23.1 U3.13(GPIO10)
FAN_TACH: J7.3(TACH) R33.2 TP30.1 U3.14(GPIO11)
LAMP_ENABLE: R7.1 TP7.1 U3.17(GPIO14)
LAMP_PWM: R22.1 U3.16(GPIO13)
LAMP_REMOTE: J2.2 J6.2 Q1.3(D)
LCD_BACKLIGHT: R52.1 U3.37(GPIO25)
LCD_D/C: J12.10(D/C) TP33.1 U3.34(GPIO22)
LCD_SCLK: J12.9(SCLK) TP34.1 U3.29(GPIO18)
LCD_SDA: J12.11(SDA) TP32.1 U3.30(GPIO19)
LEFT: C43.2 SW2.3 SW2.4 U3.27(GPIO16)
MMWAVE_RX: R38.1 U3.2(GPIO0)
MMWAVE_TX: R37.1 U3.3(GPIO1)
nRF_SWCLK: J5.4(SWCLK) M1.15(SWDCLK)
nRF_SWDIO: J5.2(SWDIO) M1.16(SWDIO)
QSPI_SCLK: U2.6(CLK) U3.52(QSPI_SCLK)
QSPI_SDO0: U2.5(DI_(IO0)) U3.53(QSPI_SD0)
QSPI_SDO1: U2.2(DO_(IO1)) U3.55(QSPI_SD1)
QSPI_SDO2: U2.3(~{WP}_(IO2)) U3.54(QSPI_SD2)
QSPI_SDO3: U2.7(~{HOLD}_(IO3)) U3.51(QSPI_SD3)
QSPI_SS: R12.1 R24.1 U2.1(~{CS}) U3.56(QSPI_SSn)
RADIO_ENABLE: C50.2 J5.3(~{RESET}) J11.6 M1.14(/RESET) M2.8(EN) R45.1 R46.2
RADIO_RX: J11.3 M1.6(P0.05/AIN1) M2.30(U0RXD/GPIO17/FSPICS1) R47.2
RADIO_TX: J11.4 M1.5(P0.04/AIN0) M2.31(U0TXD/GPIO16/FSPICS0) R48.2
RIGHT: C52.2 SW7.3 SW7.4 U3.31(GPIO20)
RUN: R36.2 SW6.3 SW6.4 U3.26(RUN)
SCL: R31.2 U3.5(GPIO3) U7.4(SCL/SPC) U8.1(SCL)
SDA: R32.2 U3.4(GPIO2) U7.6(SDA/SDI/SDO) U8.6(SDA)
SWCLK: J4.4(SWCLK) U3.24(SWCLK)
SWDIO: J4.2(SWDIO) U3.25(SWDIO)
UART_RX: R43.1 U3.11(GPIO8)
UART_TX: R42.1 U3.12(GPIO9)
UP: C42.2 SW1.3 SW1.4 U3.40(GPIO28/ADC2)
USB0_D+: R25.2
USB0_D-: R26.2
USB1_D+: R25.1 U3.47(USB_D+)
USB1_D-: R26.1 U3.46(USB_D-)
VBUS_VSENSE: U3.38(GPIO26/ADC0)
NetC17_2: C17.2 C18.2 C19.2 U3.23(DVDD) U3.45(VREG_VOUT) U3.50(DVDD)
NetC20_2: C20.2 U3.20(XIN) Y1.1(OSC)
NetC21_2: C21.2 R15.1 Y1.3(OSC)
NetC36_2: C36.2 J6.3 R22.2 TP23.1
NetC41_2: C41.2 M1.17(VBAT) R13.2 TP12.1
NetJ7_4: J7.4(PWM) Q5.1(G) R23.2 R34.2 R35.1 TP31.1
NetJ8_1: J8.1(TX) R37.2
NetJ8_2: J8.2(RX) R38.2
NetJ8_3: J8.3(OUT) TP21.1
NetJ9_1: J9.1 R42.2
NetJ9_2: J9.2 R43.2
NetJ10_1: J10.1 Q5.3(D)
NetJ12_2: J12.2(LEDK) R49.1 R50.1 R51.1 TP37.1
NetM1_E0: M1.E0(P1.04) TP15.1
NetM1_E2: M1.E2(P1.06) TP17.1
NetM1_Z0: M1.Z0(P1.09) TP18.1
NetM2_5: M2.5(GPIO2/LP_GPIO2/LP_UART_RTSN/ADC1_CH2/FSPIQ) TP14.1
NetM2_6: M2.6(GPIO3/LP_GPIO3/LP_UART_CTSN/ADC1_CH3) TP16.1
NetM2_12: M2.12(GPIO0/XTAL_32K_P/LP_GPIO0/LP_UART_DTRN/ADC1_CH0) TP5.1
NetM2_22: M2.22(GPIO8) R44.1
NetQ1_1: Q1.1(G) R3.2 R7.2 R40.1
NetQ6_1: Q6.1(G) R52.2 R53.1 TP43.1
NetQ6_3: Q6.3(D) R49.2 R50.2 R51.2
NetR15_2: R15.2 U3.21(XOUT)
NetR24_2: R24.2 SW4.1 SW4.2
NetR46_1: R46.1 U3.8(GPIO6)
NetR47_1: R47.1 U3.6(GPIO4)
NetR48_1: R48.1 U3.7(GPIO5)

Not connected (* = marked no-connect by the designer): J4 1(VCC)* 3(~{RESET})* 6(SWO)*; J5 6(SWO)*; J12 12(TE)*; M1 1(P1.02)* 2(P1.03)* 3(NC)* 4(NC)* 7(P0.02/NFC1)* 8(P0.03/NFC2)* 11(P0.09/MOSI)* 12(P0.11)* 13(NC)* A1(P0.06/AIN2)* A2(P0.07/AIN3)* A3(P0.08/SCK)* A4(P0.16/IO3)* A5(P1.00)* A6(P1.08)* B1(P0.19)* B2(P0.17/SCK)* B3(P0.14/IO1)* B4(P0.15/IO2)* B5(NC)* B6(P0.13/IO0)* C1(NC)* C2(P0.21)* C3(NC)* C4(NC)* C5(P0.20)* C6(P0.25/AIN4)* D1(P0.26/AIN5)* D2(P0.27/AIN6)* D3(NC)* D4(NC)* D5(P0.22)* D6(P1.01)* E1(P1.05)* E3(P1.07)* E4(D+)* E5(D-)* E6(P0.10/MISO)* F3(P0.18/CSN)* F5(NC)* F6(VBUS)* Z1(P1.10)* Z2(P1.11)* Z3(P1.12)* Z4(P1.13)* Z5(P1.14)* Z6(P1.15)*; M2 4(NC)* 7(NC)* 9(MTMS/GPIO4/LP_GPIO4/LP_UART_RXD/ADC1_CH4/FSPIHD)* 10(MTDI/GPIO5/LP_GPIO5/LP_UART_TXD/ADC1_CH5/FSPIWP)* 13(GPIO1/XTAL_32K_N/LP_GPIO1/LP_UART_DSRN/ADC1_CH1)* 15(MTCK/GPIO6/LP_GPIO6/LP_I2C_SDA/ADC1_CH6/FSPICLK)* 16(MTDO/GPIO7/LP_GPIO7/LP_I2C_SCL/FSPID)* 17(GPIO12/USB_D-)* 18(GPIO13/USB_D+)* 19(GPIO14)* 20(GPIO15)* 21(NC)* 24(GPIO18/SDIO_CMD/FSPICS2)* 25(GPIO19/SDIO_CLK/FSPICS3)* 26(GPIO20/SDIO_DATA0/FSPICS4)* 27(GPIO21/SDIO_DATA1/FSPICS5)* 28(GPIO22/SDIO_DATA2)* 29(GPIO23/SDIO_DATA3)* 32(NC)* 33(NC)* 34(NC)* 35(NC)*; U7 2(NC)* 3(NC)* 9(INT2)* 11(INT1)* 13(ADC3)* 15(ADC2)* 16(ADC1)*; U8 5(~{INT})*

### Layout directives
differential pair; differential pair class USB_DIFF: USB0_D+, USB0_D-, USB1_D+, USB1_D-
net class 90_OHM: SWDIO, USB0_D+, USB0_D-, USB1_D+, USB1_D-

### Notes on the sheet
- (near C9) Microcontroller
- Flash
- Magnet Sensor
- I2C Address:
  SA0 = High: 0x19 (0011001)
  SA0 = Low: 0x18 (0011000)
- CS:
  High = I2C
  Low = SPI
- (near U8) I2C Address:
  0x35 (110101)
- (near R31) I2C Pullups
- Tried by fire
- (near U7) Tried by fire
- User Buttons
- USHIO PXZ120I1/2 Ballast Connector
- (near R22) USHIO PXZ120I3 Ballast Connector
- Backlight forward voltage: 2.8V - 3.2V
  Backlight current: 45mA - 60mA
  I = (Vs - Vf) / R
  55mA - 11mA
- The alternate connector pin numbering is backwards according to Molex's documentation.
- mmWave Radar
- (near R38) Current consumption: 200 mA
- Baud rate: 256000, 8N1
- 670 Transfer Road
- St. Paul, MN 55114
- Sheet Title:
- Project:
- CONFIDENTIAL - NOT FOR RELEASE UNLESS AUTHORIZED
- USA
- Client:
- Filename:
- Date:
- Revision:
- Sheet:
- of
- A2
- (in symbol WT02C40C) Radio